# EAGLE design ioboard (EAGLE 9.6.2)
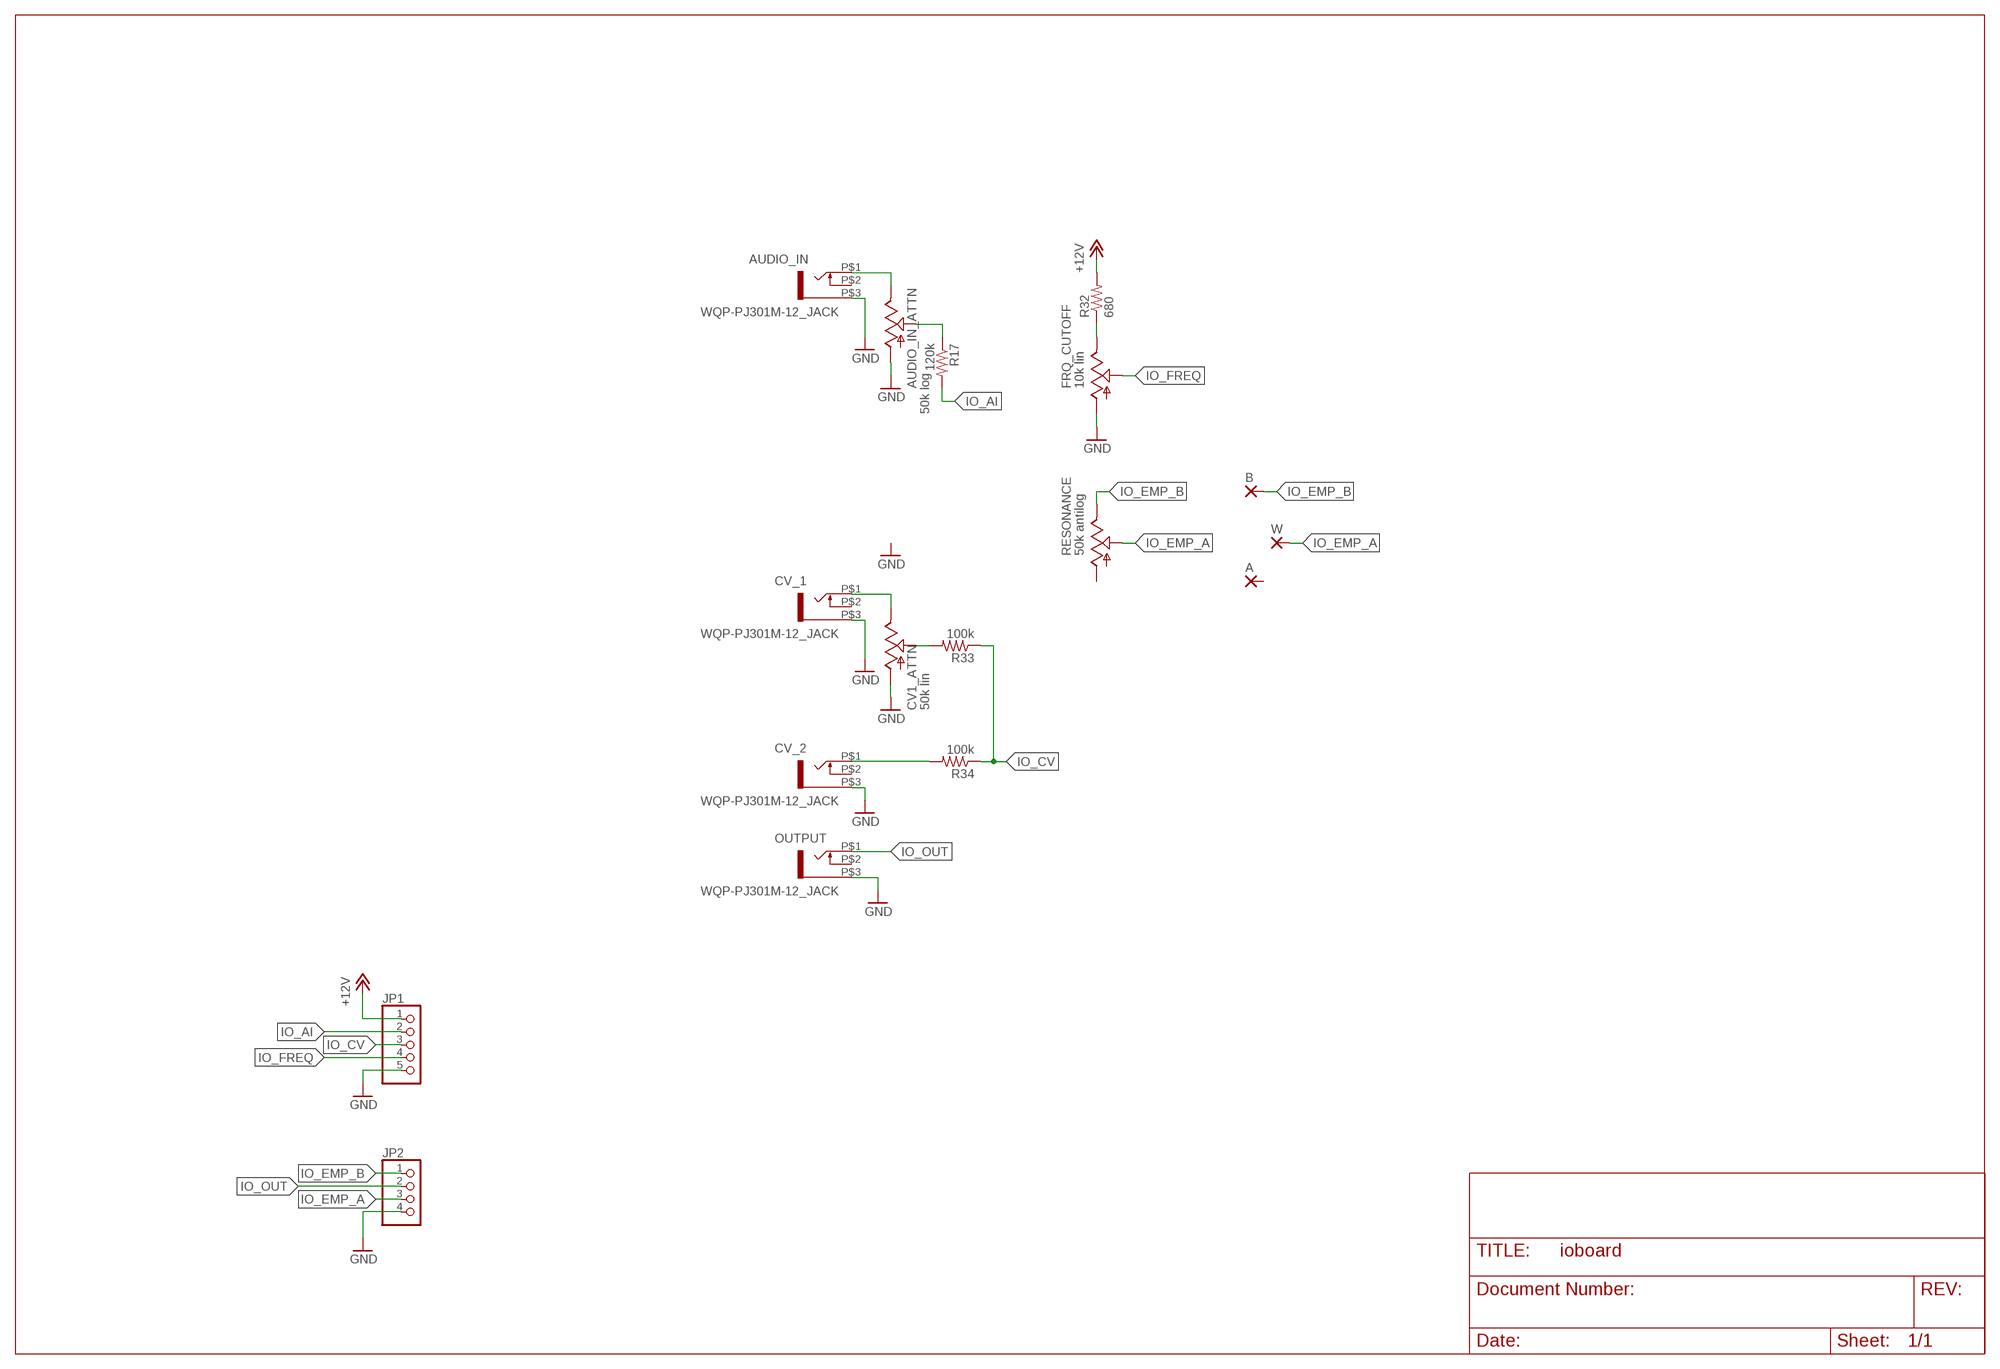
[diagram p0: schematic, sheet 1]

## Parts
A  2,15/1,0  [2,15/1,0]
AUDIO_IN  WQP-PJ301M-12_JACK  [WQP-PJ301M-12_JACK]
AUDIO_IN_ATTN  50k log  ALPHA-9MMA  [EVUF]
B  2,15/1,0  [2,15/1,0]
CV1_ATTN  50k lin  ALPHA-9MMA  [EVUF]
CV_1  WQP-PJ301M-12_JACK  [WQP-PJ301M-12_JACK]
CV_2  WQP-PJ301M-12_JACK  [WQP-PJ301M-12_JACK]
FRQ_CUTOFF  10k lin  ALPHA-9MMA  [EVUF]
JP1  PINHD-1X5  [1X05]
JP2  PINHD-1X4  [1X04]
OUTPUT  WQP-PJ301M-12_JACK  [WQP-PJ301M-12_JACK]
R17  120k  R-US_0204/7  [0204/7]
R32  680  R-US_0204/7  [0204/7]
R33  100k  R-US_0204/7  [0204/7]
R34  100k  R-US_0204/7  [0204/7]
RESONANCE  50k antilog  ALPHA-9MMA  [EVUF]
W  2,15/1,0  [2,15/1,0]

## Nets
+12V: JP1.1 R32.2
GND: AUDIO_IN.P$3 AUDIO_IN_ATTN.1(A) CV1_ATTN.1(A) CV_1.P$3 CV_2.P$3 FRQ_CUTOFF.1(A) JP1.5 JP2.4 OUTPUT.P$3
IO_AI: JP1.2 R17.2
IO_AI_1: AUDIO_IN_ATTN.2(S) R17.1
IO_CV: JP1.3 R33.1 R34.1
IO_EMP_A: JP2.3 RESONANCE.2(S) W.1(P)
IO_EMP_B: B.1(P) JP2.1 RESONANCE.3(E)
IO_FREQ: FRQ_CUTOFF.2(S) JP1.4
IO_OUT: JP2.2 OUTPUT.P$1
N$45: FRQ_CUTOFF.3(E) R32.1
N$46: CV1_ATTN.3(E) CV_1.P$1
N$47: CV1_ATTN.2(S) R33.2
N$48: CV_2.P$1 R34.2
N$50: AUDIO_IN.P$1 AUDIO_IN_ATTN.3(E)
Unconnected: A.1(P) AUDIO_IN.P$2 CV_1.P$2 CV_2.P$2 OUTPUT.P$2 RESONANCE.1(A)

## Library data of the parts
A B W = wirepad:2,15/1,0: THROUGH-HOLE PAD
AUDIO_IN CV_1 CV_2 OUTPUT = thonkiconn:WQP-PJ301M-12_JACK
AUDIO_IN_ATTN CV1_ATTN FRQ_CUTOFF RESONANCE = TomW:ALPHA-9MM: 9 mm Square Rotary Potentiometers Source: Panasonic
JP1 = pinhead:PINHD-1X5: PIN HEADER
JP2 = pinhead:PINHD-1X4: PIN HEADER
R17 R32-R34 = resistor:R-US_: RESISTOR, American symbol

## Board
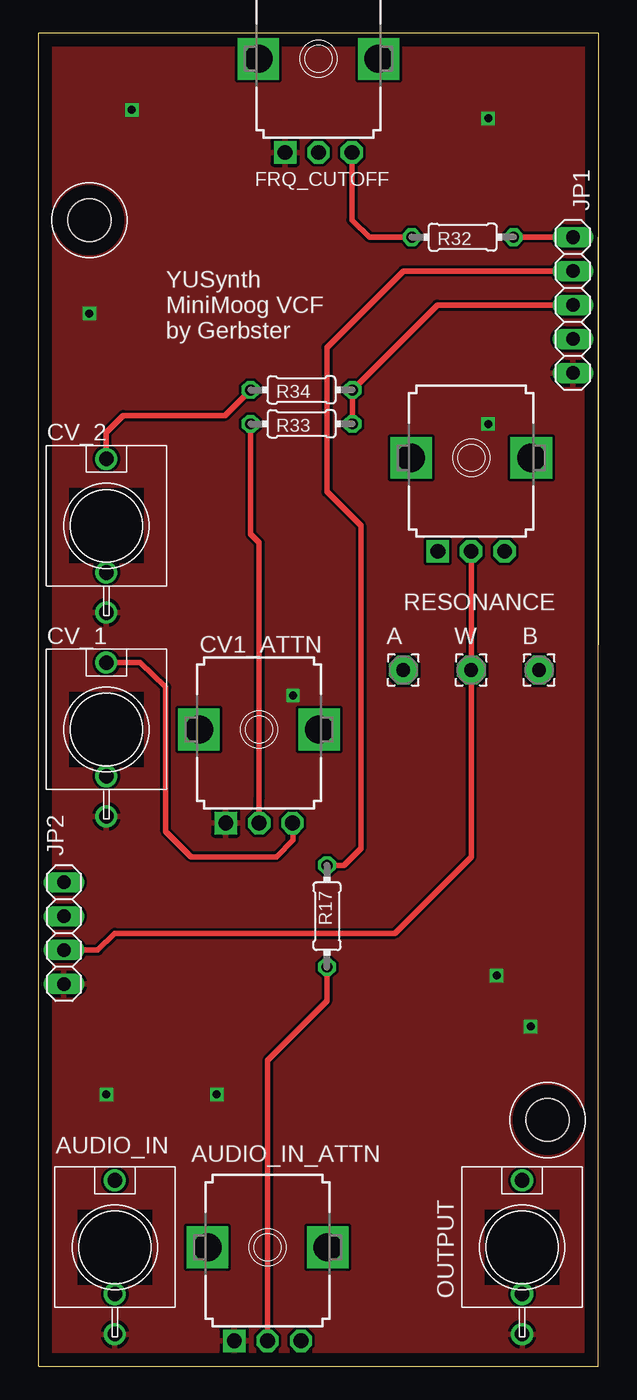
[diagram p1: board, top side]
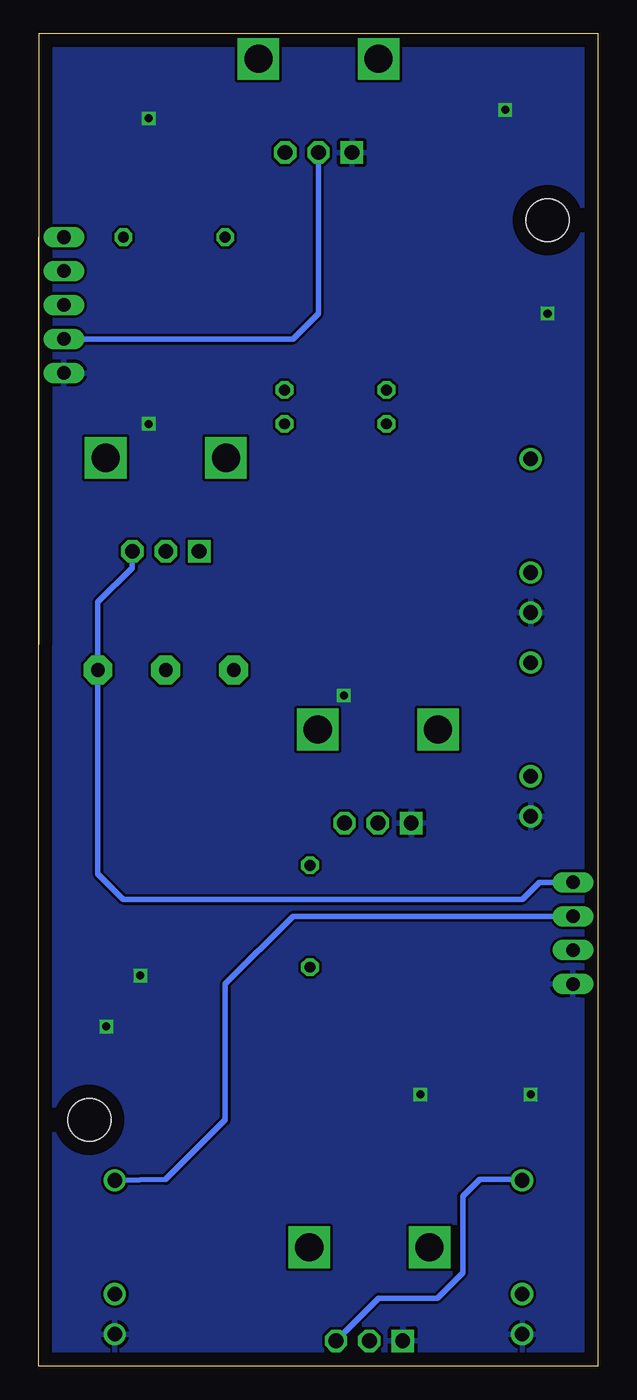
[diagram p2: board, bottom side, seen from below]

Size 41.91 x 99.69 mm. Coordinates in mm from the lower left corner, seen from the top.
Outline: 41.91,84.45 41.91,0 0,0 0,99.69 41.91,99.69 41.91,53.98
Copper layers (1*16): Top 0.035mm / dielectric 1.5mm / Bottom 0.035mm
Design rules "default": minimum track width 10mil, minimum drill 24mil, track to track 8mil, track to pad 8mil, pad to pad 8mil, via to via 8mil, smd to smd 8mil, copper to edge 40mil, drill to drill 8mil, minimum pad ring 10mil, minimum via ring 8mil, stop-mask expansion 4mil, vias tented up to drill 0mil, thermal gap 10mil
Holes 3.2 mm at 3.81,85.72 38.1,18.41

### Footprints (pad centres in the part's own frame; a part is rotated, then mirrored left to right if it is on the bottom)
2,15/1,0 = drill 1.016 pad 2.159 octagon: 1 0,0
WQP-PJ301M-12_JACK = drill 1.1: P$1 0,5; P$2 0,-3.5; P$3 0,-6.5
EVUF = drill 1.1 pad 1.676 square: 1 -2.5,-7 | drill 1.1 pad 1.676 octagon: 2 0,-7; 3 2.5,-7 | drill 2.1 pad 2.8 square: M1 4.5,0; M2 -4.5,0
1X05 = drill 1.016 long: 1 -5.08,0; 2 -2.54,0; 3 0,0; 4 2.54,0; 5 5.08,0
1X04 = drill 1.016 long: 1 -3.81,0; 2 -1.27,0; 3 1.27,0; 4 3.81,0
0204/7 = drill 0.813 octagon: 1 -3.81,0; 2 3.81,0

### Placement (x,y rotation side)
A  27.3,52.07 270 top
AUDIO_IN  5.71,8.89 0 top
AUDIO_IN_ATTN  17.14,8.89 0 top
B  37.47,52.07 270 top
CV1_ATTN  16.51,47.62 0 top
CV_1  5.08,47.62 0 top
CV_2  5.08,62.87 0 top
FRQ_CUTOFF  20.95,97.79 0 top
JP1  40.01,79.38 270 top
JP2  1.91,32.38 270 top
OUTPUT  36.2,8.89 0 top
R17  21.59,33.66 90 top
R32  31.75,84.45 0 top
R33  19.68,70.48 180 top
R34  19.68,73.03 180 top
RESONANCE  32.38,67.94 0 top
W  32.38,52.07 270 top

### Tracks (layer width: path | path; a pad name or v marks a point on that pad's centre or on a via)
+12V
  Top 0.406: JP1.1 R32.2
GND  (via drill 0.6)
  other vias: 36.83,25.4 34.29,29.21 3.81,78.74 6.99,93.98 19.05,50.16 13.34,20.32 5.08,20.32 33.66,70.48 33.66,93.34
  pour Top: 41.91,99.69 0,99.69 0,0 41.91,0
  pour Bottom: 41.91,99.69 0,99.69 0,0 41.91,0
IO_AI
  Top 0.406: JP1.2 27.3,81.92 21.59,76.2 21.59,65.41 24.13,62.87 24.13,38.73 22.86,37.47 R17.2
IO_AI_1
  Top 0.406: R17.1 21.59,27.3 17.14,22.86 AUDIO_IN_ATTN.2
IO_CV
  Top 0.406: R33.1 R34.1 29.84,79.38 JP1.3
IO_EMP_A
  Top 0.406: RESONANCE.2 W.1 32.38,38.1 26.67,32.38 5.71,32.38 4.45,31.11 JP2.3
IO_EMP_B
  Bottom 0.406: RESONANCE.3 34.88,59.69 37.47,57.15 B.1 37.47,36.83 35.56,34.92 5.71,34.92 4.45,36.2 JP2.1
IO_FREQ
  Bottom 0.406: JP1.4 22.86,76.83 20.95,78.74 FRQ_CUTOFF.2
IO_OUT
  Bottom 0.406: JP2.2 22.86,33.66 27.94,28.57 27.94,18.41 32.38,13.97 OUTPUT.P$1
N$45
  Top 0.406: FRQ_CUTOFF.3 23.45,85.72 24.77,84.45 R32.1
N$46
  Top 0.406: CV1_ATTN.3 19.05,40.01 19.05,39.37 17.81,38.1 11.43,38.1 9.53,40.01 9.53,50.8 7.62,52.62 CV_1.P$1
N$47
  Top 0.406: CV1_ATTN.2 16.51,42.53 16.51,61.59 15.88,62.23 R33.2
N$48
  Top 0.406: R34.2 13.97,71.12 6.35,71.12 5.08,69.85 CV_2.P$1
N$50
  Bottom 0.406: AUDIO_IN_ATTN.3 16.45,5.08 12.06,5.08 10.16,6.99 10.16,12.7 8.89,13.97 5.71,13.97 AUDIO_IN.P$1

### Text on the board
tNames: YUSynth / MiniMoog VCF / by Gerbster